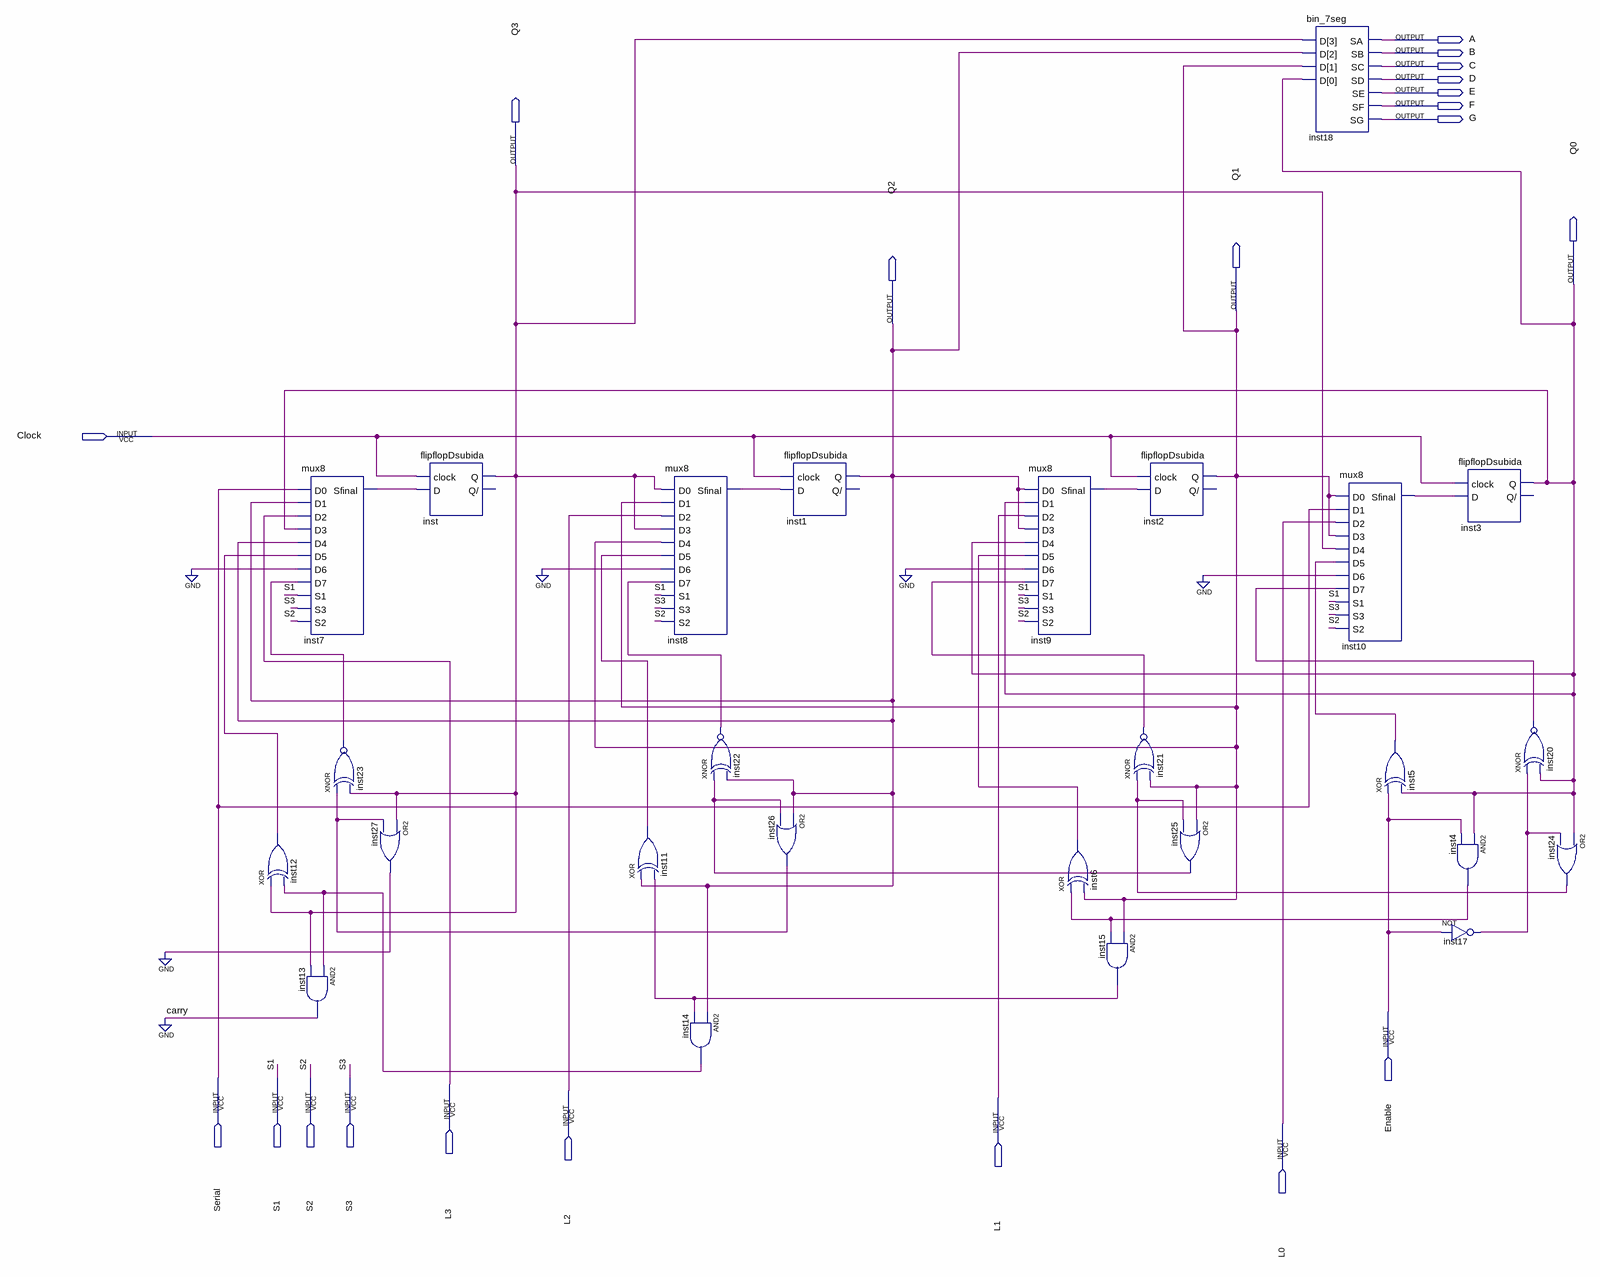
[diagram p0: schematic sheet]
// Quartus schematic register.bdf as structural Verilog: 26 symbols, 21 pins
module register (
  input  Clock,
  input  Enable,
  input  Serial,
  input  S1,
  input  S2,
  input  S3,
  input  L3,
  input  L2,
  input  L1,
  input  L0,
  output A,
  output B,
  output C,
  output D,
  output E,
  output F,
  output G,
  output Q3,
  output Q0,
  output Q1,
  output Q2
);

  wire carry, inst4_out, inst5_out, inst6_out, inst7_sfinal, inst8_sfinal, inst9_sfinal, inst10_sfinal,
       inst11_out, inst12_out, inst14_out, inst15_out, inst17_out, inst20_out, inst21_out, inst22_out,
       inst23_out, inst24_out, inst25_out, inst26_out, inst27_out;

  xor inst12 (inst12_out, Q3, inst14_out);
  mux8 inst7 (
    .D0(Serial), .D1(Q2), .D2(L3), .D3(Q0), .D4(Q2), .D5(inst12_out), .D6(1'b0), .D7(inst23_out), .S1(S1),
    .S3(S3), .S2(S2), .Sfinal(inst7_sfinal));
  xnor inst23 (inst23_out, inst26_out, Q3);
  and inst13 (carry, inst14_out, Q3);
  or inst27 (inst27_out, Q3, inst26_out);
  flipflopDsubida inst (.clock(Clock), .D(inst7_sfinal), .Q(Q3));  // open: Q/
  xor inst11 (inst11_out, Q2, inst15_out);
  mux8 inst8 (
    .D0(Q3), .D1(Q1), .D2(L2), .D3(Q3), .D4(Q1), .D5(inst11_out), .D6(1'b0), .D7(inst22_out), .S1(S1),
    .S3(S3), .S2(S2), .Sfinal(inst8_sfinal));
  and inst14 (inst14_out, Q2, inst15_out);
  xnor inst22 (inst22_out, inst25_out, Q2);
  flipflopDsubida inst1 (.clock(Clock), .D(inst8_sfinal), .Q(Q2));  // open: Q/
  or inst26 (inst26_out, Q2, inst25_out);
  mux8 inst9 (
    .D0(Q2), .D1(Q0), .D2(L1), .D3(Q2), .D4(Q0), .D5(inst6_out), .D6(1'b0), .D7(inst21_out), .S1(S1),
    .S3(S3), .S2(S2), .Sfinal(inst9_sfinal));
  xor inst6 (inst6_out, inst4_out, Q1);
  and inst15 (inst15_out, Q1, inst4_out);
  flipflopDsubida inst2 (.clock(Clock), .D(inst9_sfinal), .Q(Q1));  // open: Q/
  xnor inst21 (inst21_out, inst24_out, Q1);
  or inst25 (inst25_out, Q1, inst24_out);
  bin_7seg inst18 (.D({Q3, Q2, Q1, Q0}), .SA(A), .SB(B), .SC(C), .SD(D), .SE(E), .SF(F), .SG(G));
  mux8 inst10 (
    .D0(Q1), .D1(Serial), .D2(L0), .D3(Q1), .D4(Q3), .D5(inst5_out), .D6(1'b0), .D7(inst20_out), .S1(S1),
    .S3(S3), .S2(S2), .Sfinal(inst10_sfinal));
  xor inst5 (inst5_out, Enable, Q0);
  flipflopDsubida inst3 (.clock(Clock), .D(inst10_sfinal), .Q(Q0));  // open: Q/
  and inst4 (inst4_out, Q0, Enable);
  not inst17 (inst17_out, Enable);
  xnor inst20 (inst20_out, inst17_out, Q0);
  or inst24 (inst24_out, Q0, inst17_out);
  // also tied to GND on the sheet: {inst27_out, carry}
endmodule
